# EAGLE schematic test_add_my_res (EAGLE 6.4)
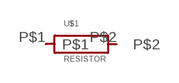
[diagram p0: schematic, sheet 1]

## Parts
U$1  RESISTOR  [0603]
Unconnected: U$1.P$1 U$1.P$2

## Library data of the parts
U$1 = my_res:RESISTOR